# EAGLE schematic digisim part 1 (EAGLE 9.6.2)
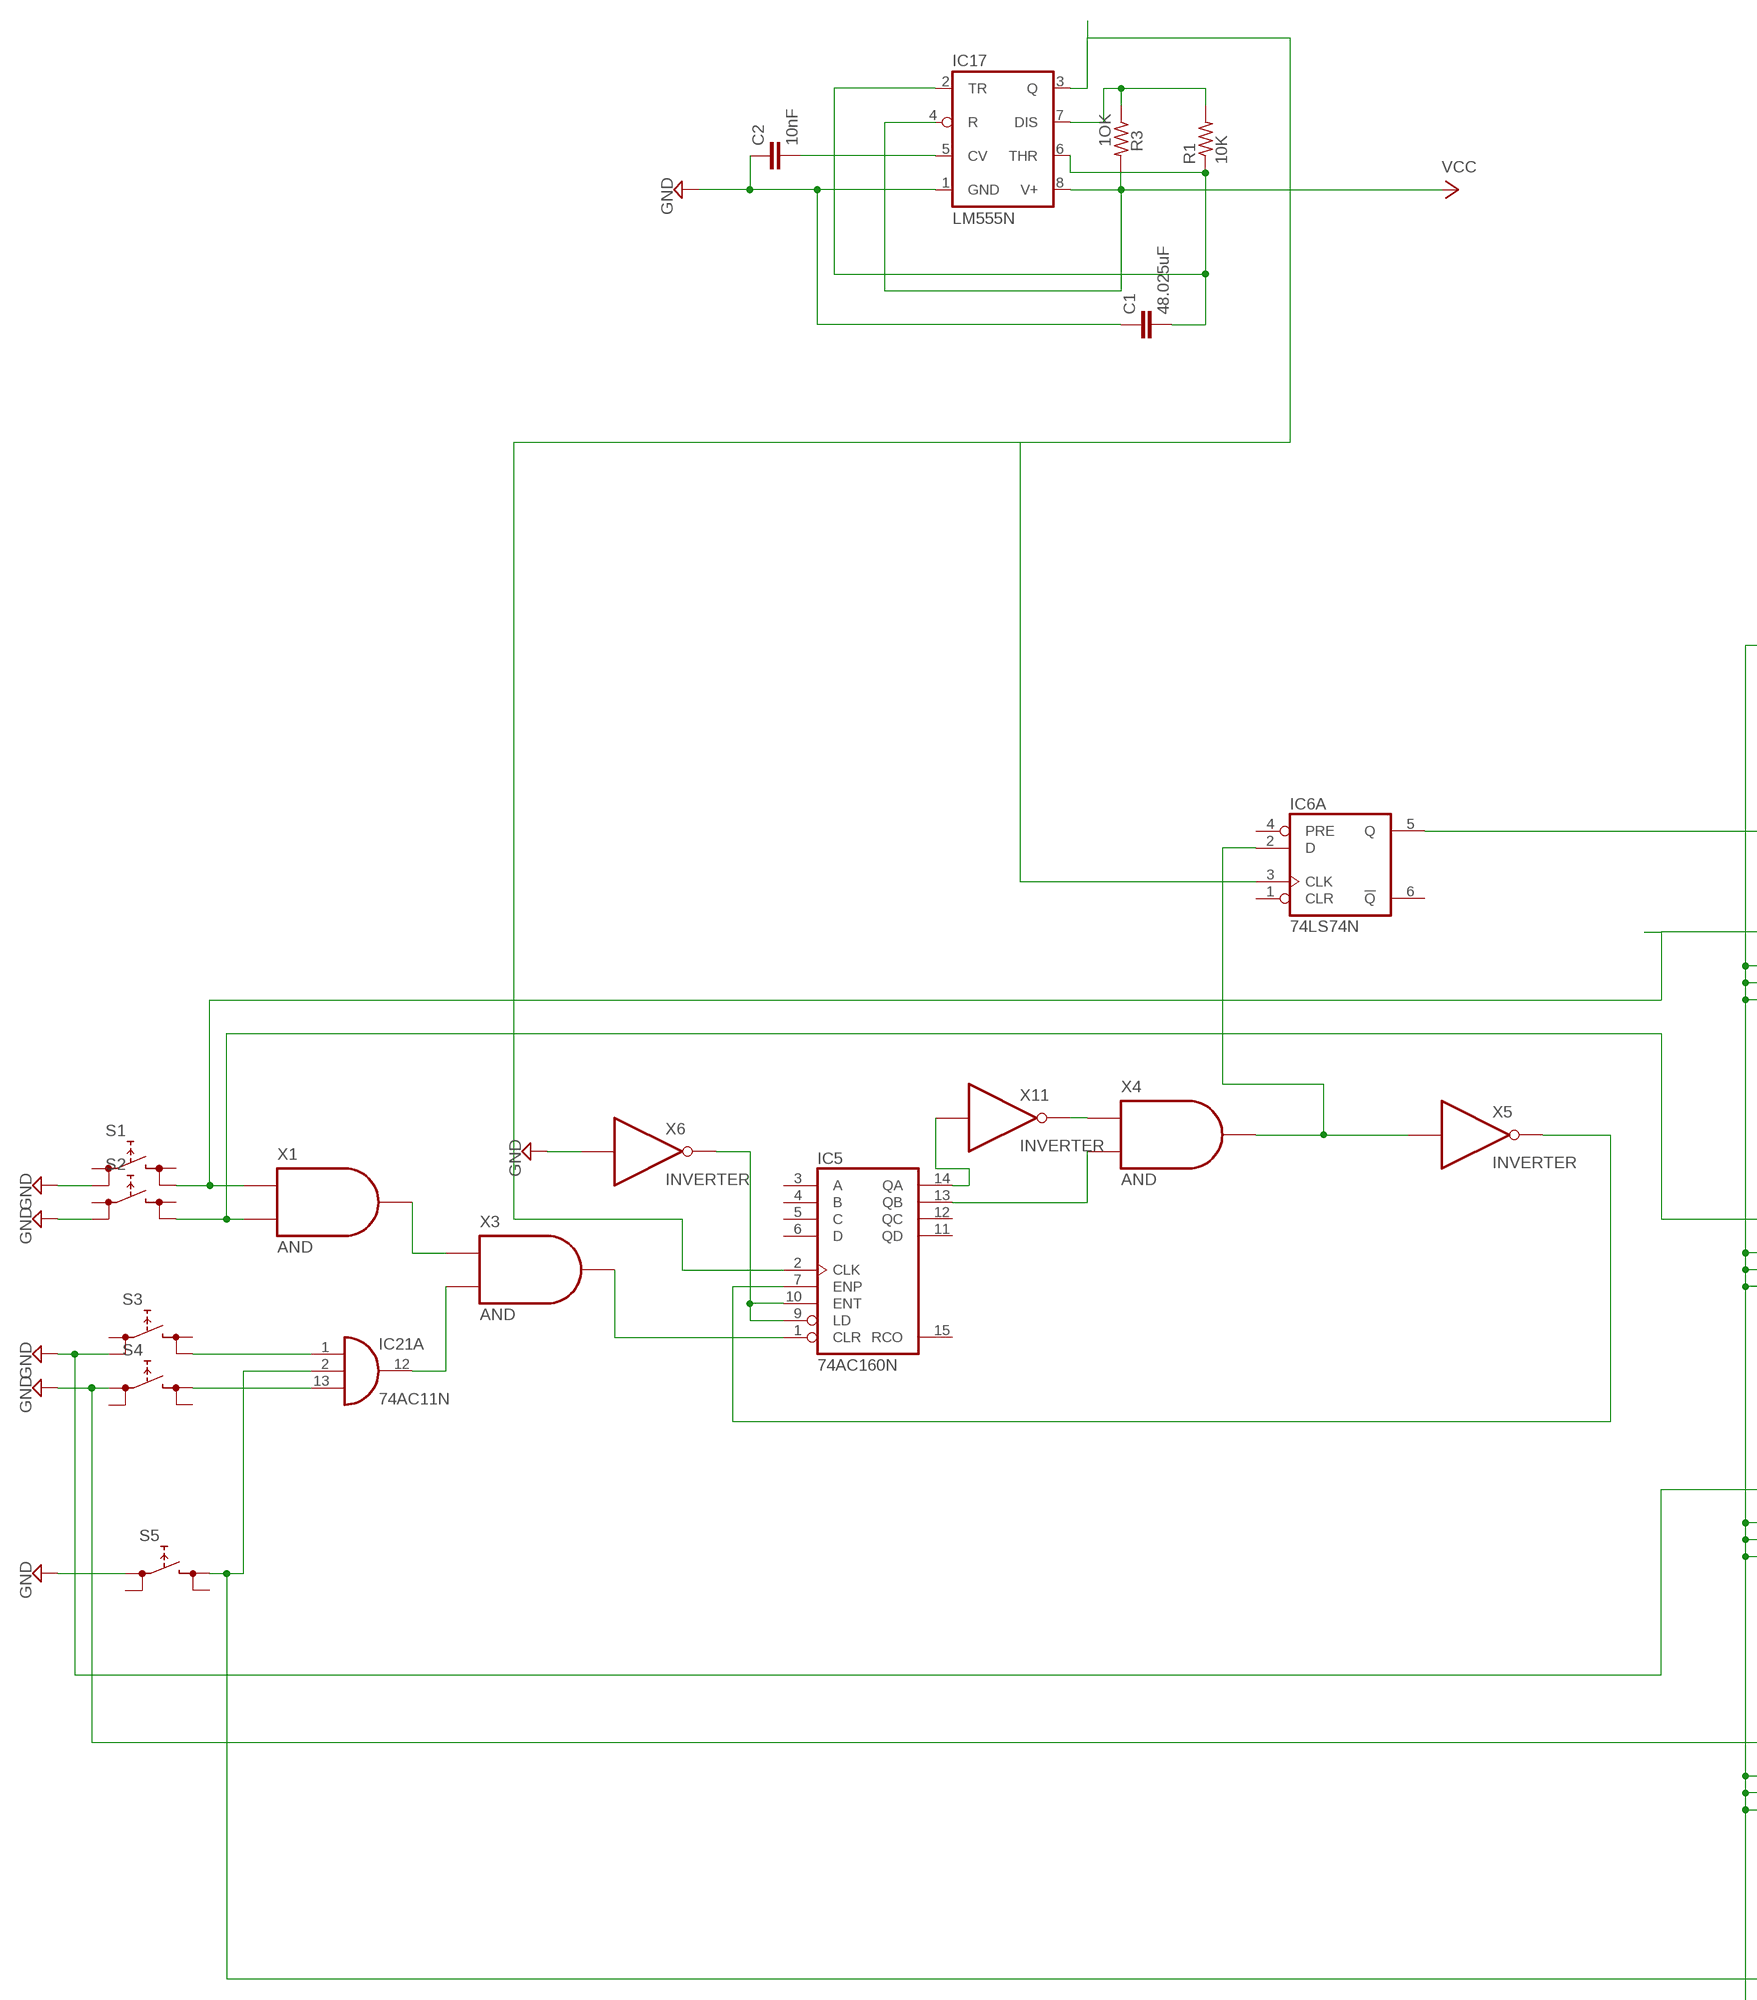
[diagram p0: schematic, sheet 1, part 1 of 2]
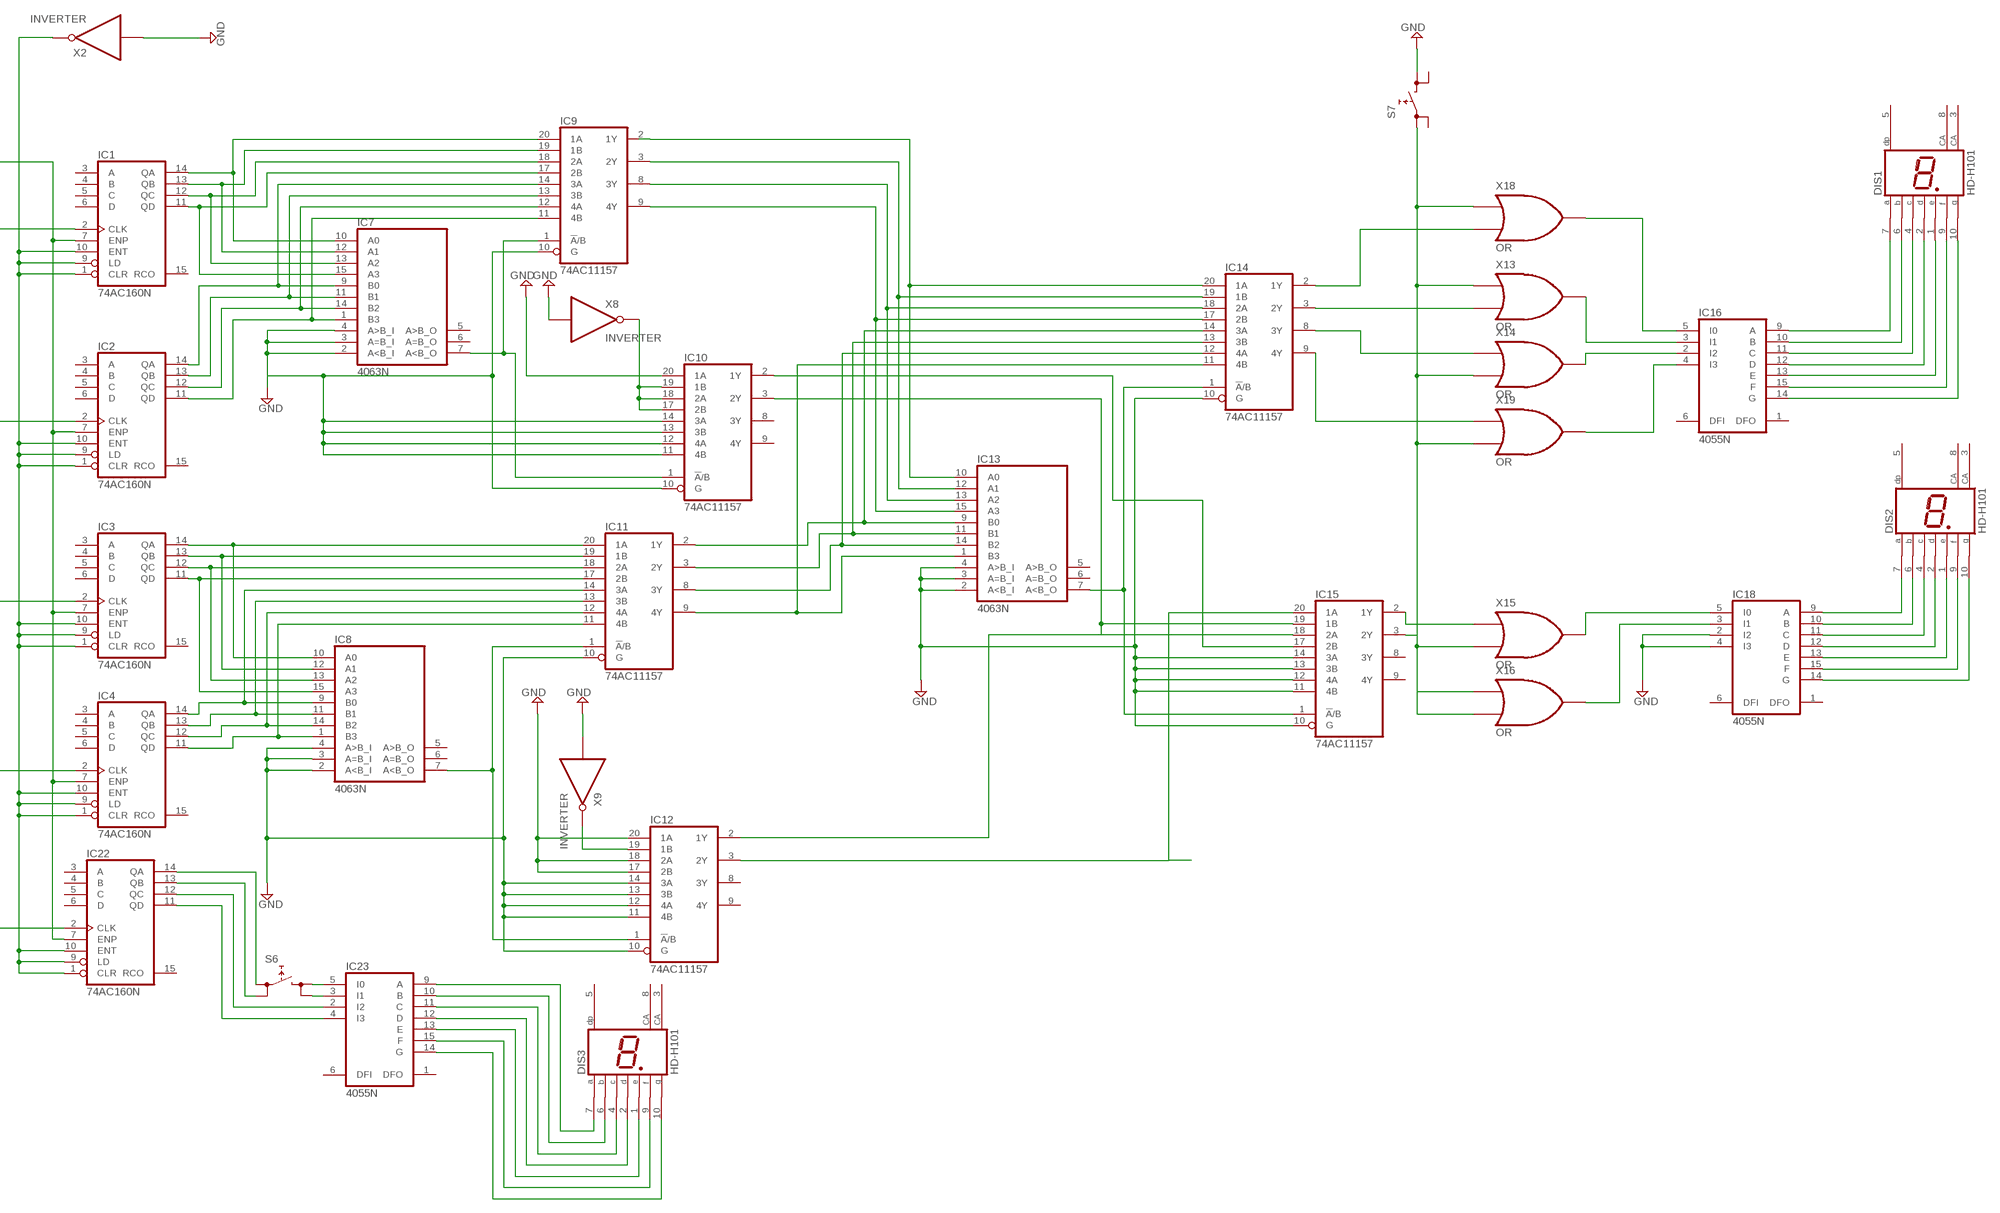
[diagram p1: schematic, sheet 1, part 2 of 2]

## Parts
C1  48.025uF  C2.5/2  [C2.5-2]
C2  10nF  C2.5/2  [C2.5-2]
DIS1  HD-H101  [HDSP-M]
DIS2  HD-H101  [HDSP-M]
DIS3  HD-H101  [HDSP-M]
IC1  74AC160N  [DIL16]
IC2  74AC160N  [DIL16]
IC3  74AC160N  [DIL16]
IC4  74AC160N  [DIL16]
IC5  74AC160N  [DIL16]
IC6  74LS74N  [DIL14]
IC7  4063N  [DIL16]
IC8  4063N  [DIL16]
IC9  74AC11157  [DIL20]
IC10  74AC11157  [DIL20]
IC11  74AC11157  [DIL20]
IC12  74AC11157  [DIL20]
IC13  4063N  [DIL16]
IC14  74AC11157  [DIL20]
IC15  74AC11157  [DIL20]
IC16  4055N  [DIL16]
IC17  LM555N  [DIL08]
IC18  4055N  [DIL16]
IC21  74AC11N  [DIL14]
IC22  74AC160N  [DIL16]
IC23  4055N  [DIL16]
R1  10K  R-US_0204/5  [0204/5]
R3  1OK  R-US_0204/2V  [0204V]
S1  REKN  [REKN]
S2  REKN  [REKN]
S3  REKN  [REKN]
S4  REKN  [REKN]
S5  REKN  [REKN]
S6  REKN  [REKN]
S7  REKN  [REKN]
X1  AND  (no package)
X2  INVERTER  (no package)
X3  AND  (no package)
X4  AND  (no package)
X5  INVERTER  (no package)
X6  INVERTER  (no package)
X8  INVERTER  (no package)
X9  INVERTER  (no package)
X11  INVERTER  (no package)
X13  OR  (no package)
X14  OR  (no package)
X15  OR  (no package)
X16  OR  (no package)
X18  OR  (no package)
X19  OR  (no package)

## Nets
GND: C1.1 C2.1 IC3.2(CLK) IC4.2(CLK) IC7.2(A<B_I) IC7.3(A=B_I) IC7.4(A>B_I) IC8.2(A<B_I) IC8.3(A=B_I) IC8.4(A>B_I) IC9.10(G) IC10.10(G) IC10.11(4B) IC10.12(4A) IC10.13(3B) IC10.14(3A) IC10.20(1A) IC11.10(G) IC12.10(G) IC12.11(4B) IC12.12(4A) IC12.13(3B) IC12.14(3A) IC12.17(2B) IC12.18(2A) IC12.20(1A) IC13.2(A<B_I) IC13.3(A=B_I) IC13.4(A>B_I) IC14.10(G) IC15.10(G) IC15.11(4B) IC15.12(4A) IC15.13(3B) IC15.14(3A) IC17.1(GND) IC18.2(I2) IC18.4(I3) S1.0B S2.0B S3.0B S4.0A S5.0A S7.1A X2.I X6.I X8.I X9.I
N$1: X1.Y X3.A
N$2: IC21.12(A:O) X3.B
N$3: IC5.1(CLR) X3.Y
N$4: IC5.14(QA) X11.I
N$5: IC5.13(QB) X4.B
N$6: IC6.2(A:D) X4.Y X5.I
N$7: IC5.7(ENP) X5.O
N$8: IC22.14(QA) S6.0A
N$9: IC5.9(LD) IC5.10(ENT) X6.O
N$10: IC1.1(CLR) IC1.9(LD) IC1.10(ENT) IC2.1(CLR) IC2.9(LD) IC2.10(ENT) IC3.1(CLR) IC3.9(LD) IC3.10(ENT) IC4.1(CLR) IC4.9(LD) IC4.10(ENT) IC22.1(CLR) IC22.9(LD) IC22.10(ENT) X2.O
N$11: IC1.2(CLK) S1.1B X1.A
N$12: IC2.2(CLK) S2.1B X1.B
N$13: IC21.1(A:I0) S3.1B
N$14: IC21.13(A:I2) S4.1A
N$15: IC1.14(QA) IC7.10(A0) IC9.20(1A)
N$16: IC1.13(QB) IC7.12(A1) IC9.19(1B)
N$17: IC1.12(QC) IC7.13(A2) IC9.18(2A)
N$18: IC1.11(QD) IC7.15(A3) IC9.17(2B)
N$19: IC2.14(QA) IC7.9(B0) IC9.14(3A)
N$20: IC2.13(QB) IC7.11(B1) IC9.13(3B)
N$21: IC2.12(QC) IC7.14(B2) IC9.12(4A)
N$22: IC2.11(QD) IC7.1(B3) IC9.11(4B)
N$23: IC7.7(A<B_O) IC9.1(!A!/B) IC10.1(!A!/B)
N$24: IC3.14(QA) IC8.10(A0) IC11.20(1A)
N$25: IC3.13(QB) IC8.12(A1) IC11.19(1B)
N$26: IC3.12(QC) IC8.13(A2) IC11.18(2A)
N$27: IC3.11(QD) IC8.15(A3) IC11.17(2B)
N$28: IC4.14(QA) IC8.9(B0) IC11.14(3A)
N$29: IC4.13(QB) IC8.11(B1) IC11.13(3B)
N$30: IC4.12(QC) IC8.14(B2) IC11.12(4A)
N$31: IC4.11(QD) IC8.1(B3) IC11.11(4B)
N$32: IC10.17(2B) IC10.18(2A) IC10.19(1B) X8.O
N$33: IC8.7(A<B_O) IC11.1(!A!/B) IC12.1(!A!/B)
N$34: IC12.19(1B) X9.O
N$35: IC9.2(1Y) IC13.10(A0) IC14.20(1A)
N$36: IC9.3(2Y) IC13.12(A1) IC14.19(1B)
N$37: IC9.8(3Y) IC13.13(A2) IC14.18(2A)
N$38: IC9.9(4Y) IC13.15(A3) IC14.17(2B)
N$39: IC11.2(1Y) IC13.9(B0) IC14.14(3A)
N$40: IC11.3(2Y) IC13.11(B1) IC14.13(3B)
N$41: X4.A X11.O
N$42: IC1.7(ENP) IC2.7(ENP) IC3.7(ENP) IC4.7(ENP) IC6.5(A:Q) IC22.7(ENP)
N$43: IC12.2(1Y) IC15.18(2A)
N$44: IC13.7(A<B_O) IC14.1(!A!/B) IC15.1(!A!/B)
N$45: IC10.2(1Y) IC15.17(2B)
N$46: IC10.3(2Y) IC15.19(1B)
N$47: IC12.3(2Y) IC15.20(1A)
N$48: IC14.2(1Y) X18.B
N$49: IC14.3(2Y) X13.B
N$50: IC14.8(3Y) X14.A
N$51: IC14.9(4Y) X19.A
N$52: IC15.2(1Y) X15.A
N$53: IC15.3(2Y) X16.A
N$54: IC16.5(I0) X18.Y
N$55: IC16.3(I1) X13.Y
N$56: IC16.2(I2) X14.Y
N$57: IC16.4(I3) X19.Y
N$58: IC18.5(I0) X15.Y
N$59: IC18.3(I1) X16.Y
N$60: S7.0A X13.A X14.B X15.B X16.B X18.A X19.B
N$61: DIS1.7(A) IC16.9(A)
N$62: DIS1.6(B) IC16.10(B)
N$63: DIS1.4(C) IC16.11(C)
N$64: DIS1.2(D) IC16.12(D)
N$65: DIS1.1(E) IC16.13(E)
N$66: DIS1.9(F) IC16.15(F)
N$67: DIS1.10(G) IC16.14(G)
N$68: DIS2.7(A) IC18.9(A)
N$69: DIS2.6(B) IC18.10(B)
N$70: IC11.9(4Y) IC13.1(B3) IC14.11(4B)
N$71: IC11.8(3Y) IC13.14(B2) IC14.12(4A)
N$79: IC21.2(A:I1) IC22.2(CLK) S5.1A
N$81: IC22.13(QB) S6.0B
N$82: IC22.12(QC) IC23.2(I2)
N$83: IC22.11(QD) IC23.4(I3)
N$84: DIS3.7(A) IC23.9(A)
N$85: DIS3.6(B) IC23.10(B)
N$86: DIS3.4(C) IC23.11(C)
N$87: DIS3.2(D) IC23.12(D)
N$88: DIS3.1(E) IC23.13(E)
N$89: DIS3.9(F) IC23.15(F)
N$90: DIS3.10(G) IC23.14(G)
N$91: IC23.3(I1) S6.1B
N$92: IC23.5(I0) S6.1A
N$93: DIS2.4(C) IC18.11(C)
N$94: DIS2.2(D) IC18.12(D)
N$95: DIS2.1(E) IC18.13(E)
N$96: DIS2.9(F) IC18.15(F)
N$97: DIS2.10(G) IC18.14(G)
N$98: C2.2 IC17.5(CV)
N$99: IC17.7(DIS) R1.2 R3.1
N$100: C1.2 IC17.2(TR) IC17.6(THR) R1.1
N$101: IC5.2(CLK) IC6.3(A:CLK) IC17.3(Q)
VCC: IC17.4(R) IC17.8(V+) R3.2
Unconnected: DIS1.3(CA) DIS1.5(DP) DIS1.8(CA) DIS2.3(CA) DIS2.5(DP) DIS2.8(CA) DIS3.3(CA) DIS3.5(DP) DIS3.8(CA) IC1.3(A) IC1.4(B) IC1.5(C) IC1.6(D) IC1.15(RCO) IC2.3(A) IC2.4(B) IC2.5(C) IC2.6(D) IC2.15(RCO) IC3.3(A) IC3.4(B) IC3.5(C) IC3.6(D) IC3.15(RCO) IC4.3(A) IC4.4(B) IC4.5(C) IC4.6(D) IC4.15(RCO) IC5.3(A) IC5.4(B) IC5.5(C) IC5.6(D) IC5.11(QD) IC5.12(QC) IC5.15(RCO) IC6.1(A:CLR) IC6.4(A:PRE) IC6.6(A:!Q) IC6.8(B:!Q) IC6.9(B:Q) IC6.10(B:PRE) IC6.11(B:CLK) IC6.12(B:D) IC6.13(B:CLR) IC7.5(A>B_O) IC7.6(A=B_O) IC8.5(A>B_O) IC8.6(A=B_O) IC10.8(3Y) IC10.9(4Y) IC12.8(3Y) IC12.9(4Y) IC13.5(A>B_O) IC13.6(A=B_O) IC15.8(3Y) IC15.9(4Y) IC16.1(DFO) IC16.6(DFI) IC18.1(DFO) IC18.6(DFI) IC21.3(B:I0) IC21.4(B:I1) IC21.5(B:I2) IC21.6(B:O) IC21.8(C:O) IC21.9(C:I0) IC21.10(C:I1) IC21.11(C:I2) IC22.3(A) IC22.4(B) IC22.5(C) IC22.6(D) IC22.15(RCO) IC23.1(DFO) IC23.6(DFI) S1.0A S1.1A S2.0A S2.1A S3.0A S3.1A S4.0B S4.1B S5.0B S5.1B S7.0B S7.1B

## Power pins joined to a net without a drawn wire
GND: IC1.8(GND) IC2.8(GND) IC3.8(GND) IC4.8(GND) IC5.8(GND) IC6.7(P:GND) IC9.4(GND) IC9.5(GND) IC9.6(GND) IC9.7(GND) IC10.4(GND) IC10.5(GND) IC10.6(GND) IC10.7(GND) IC11.4(GND) IC11.5(GND) IC11.6(GND) IC11.7(GND) IC12.4(GND) IC12.5(GND) IC12.6(GND) IC12.7(GND) IC14.4(GND) IC14.5(GND) IC14.6(GND) IC14.7(GND) IC15.4(GND) IC15.5(GND) IC15.6(GND) IC15.7(GND) IC16.8(GND) IC18.8(GND) IC21.7(P:GND) IC22.8(GND) IC23.8(GND)
VCC: IC1.16(VCC) IC2.16(VCC) IC3.16(VCC) IC4.16(VCC) IC5.16(VCC) IC6.14(P:VCC) IC9.15(VCC) IC9.16(VCC) IC10.15(VCC) IC10.16(VCC) IC11.15(VCC) IC11.16(VCC) IC12.15(VCC) IC12.16(VCC) IC14.15(VCC) IC14.16(VCC) IC15.15(VCC) IC15.16(VCC) IC16.16(VCC) IC18.16(VCC) IC21.14(P:VCC) IC22.16(VCC) IC23.16(VCC)
VDD: IC7.16(VDD) IC8.16(VDD) IC13.16(VDD)
VEE: IC16.7(VEE) IC18.7(VEE) IC23.7(VEE)
VSS: IC7.8(VSS) IC8.8(VSS) IC13.8(VSS)

## Library data of the parts
C1 C2 = capacitor-wima:C: CAPACITOR naming: grid - package width
DIS1-DIS3 = display-hp:HD-H101: LED DISPLAY 1-character 7 segment, decimal point right; OC_FARNELL: unknown; OC_NEWARK: unknown
IC1-IC5 IC22 = 74xx-eu:74*160: Synchronous 4-bit COUNTER
IC6 = 74xx-us:74*74: Dual D type positive edge triggered FLIP FLOP, preset and clear
IC7 IC8 IC13 = 40xx:4063: 4-bit magnitude COMPARATOR
IC9-IC12 IC14 IC15 = 74ac-logic:74AC11157: Quadruple 2 to 1 line DATA SELECTOR/MULTIPLEXER
IC16 IC18 IC23 = 40xx:4055: BCD to 7-segment LCD DRIVER
IC17 = linear:*555: TIMER
IC21 = 74xx-eu:74*11: Triple 3-input AND gate
R1 R3 = rcl:R-US_: RESISTOR, American symbol; SPICEPREFIX: R
S1-S7 = switch:REKN: PUSH SWITCH ITT-Cannon-Cannon
X1 X3 X4 = ngspice-digital:AND: 2 input logic AND gate
X2 X5 X6 X8 X9 X11 = ngspice-digital:INVERTER: logic inverter (NOT gate)
X13-X16 X18 X19 = ngspice-digital:OR: 2 input logic OR gate

## Module SSS
Ports: N$5(io)
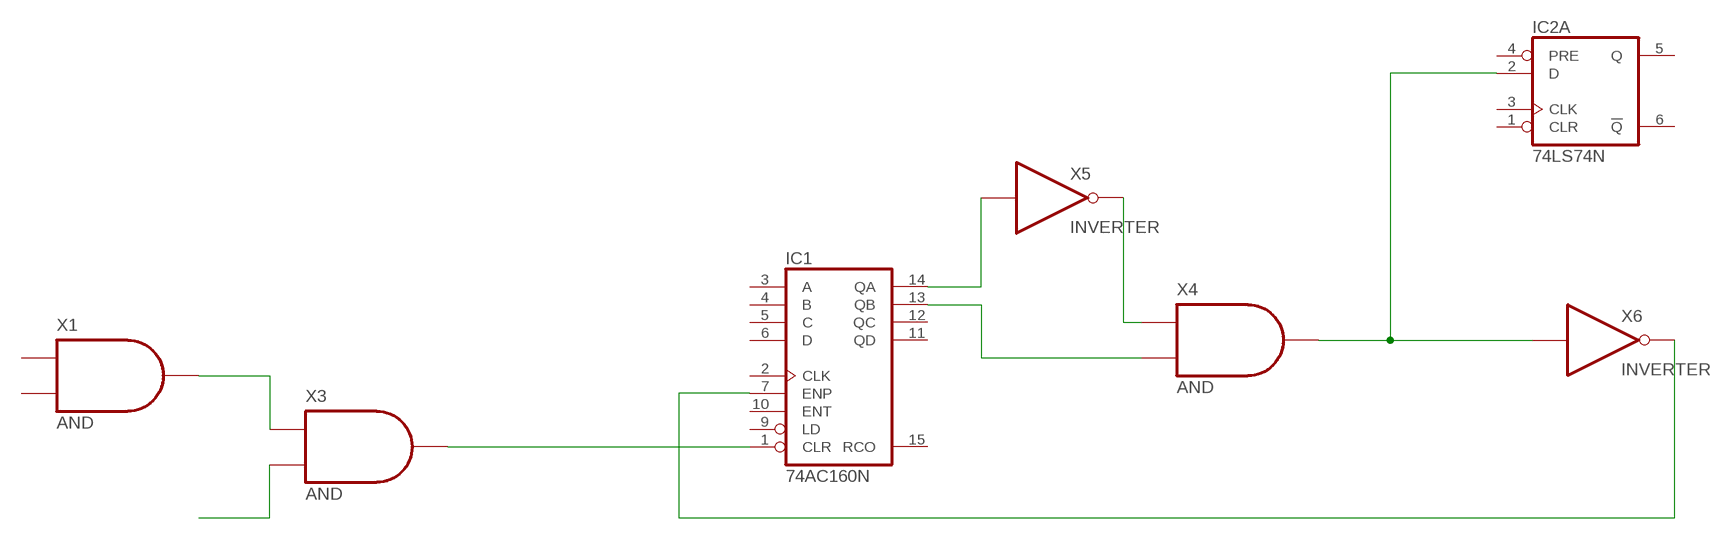
[diagram p2: schematic, module SSS, sheet 1]

### Parts
IC1  74AC160N  [DIL16]
IC2  74LS74N  [DIL14]
X1  AND  (no package)
X3  AND  (no package)
X4  AND  (no package)
X5  INVERTER  (no package)
X6  INVERTER  (no package)

### Nets
N$1: X1.Y X3.A
N$2: X3.B
N$3: IC1.1(CLR) X3.Y
N$4: IC1.14(QA) X5.I
N$5: IC1.13(QB) X4.B
N$6: X4.A X5.O
N$7: IC2.2(A:D) X4.Y X6.I
N$8: IC1.7(ENP) X6.O
Unconnected: IC1.2(CLK) IC1.3(A) IC1.4(B) IC1.5(C) IC1.6(D) IC1.9(LD) IC1.10(ENT) IC1.11(QD) IC1.12(QC) IC1.15(RCO) IC2.1(A:CLR) IC2.3(A:CLK) IC2.4(A:PRE) IC2.5(A:Q) IC2.6(A:!Q) IC2.8(B:!Q) IC2.9(B:Q) IC2.10(B:PRE) IC2.11(B:CLK) IC2.12(B:D) IC2.13(B:CLR) X1.A X1.B

### Power pins joined to a net without a drawn wire
GND: IC1.8(GND) IC2.7(P:GND)
VCC: IC1.16(VCC) IC2.14(P:VCC)

### Library data of the parts
IC1 = 74xx-eu:74*160: Synchronous 4-bit COUNTER
IC2 = 74xx-us:74*74: Dual D type positive edge triggered FLIP FLOP, preset and clear
X1 X3 X4 = ngspice-digital:AND: 2 input logic AND gate
X5 X6 = ngspice-digital:INVERTER: logic inverter (NOT gate)